# EAGLE design WiFiSensorLTC3559Spansion (EAGLE 7.3.0)
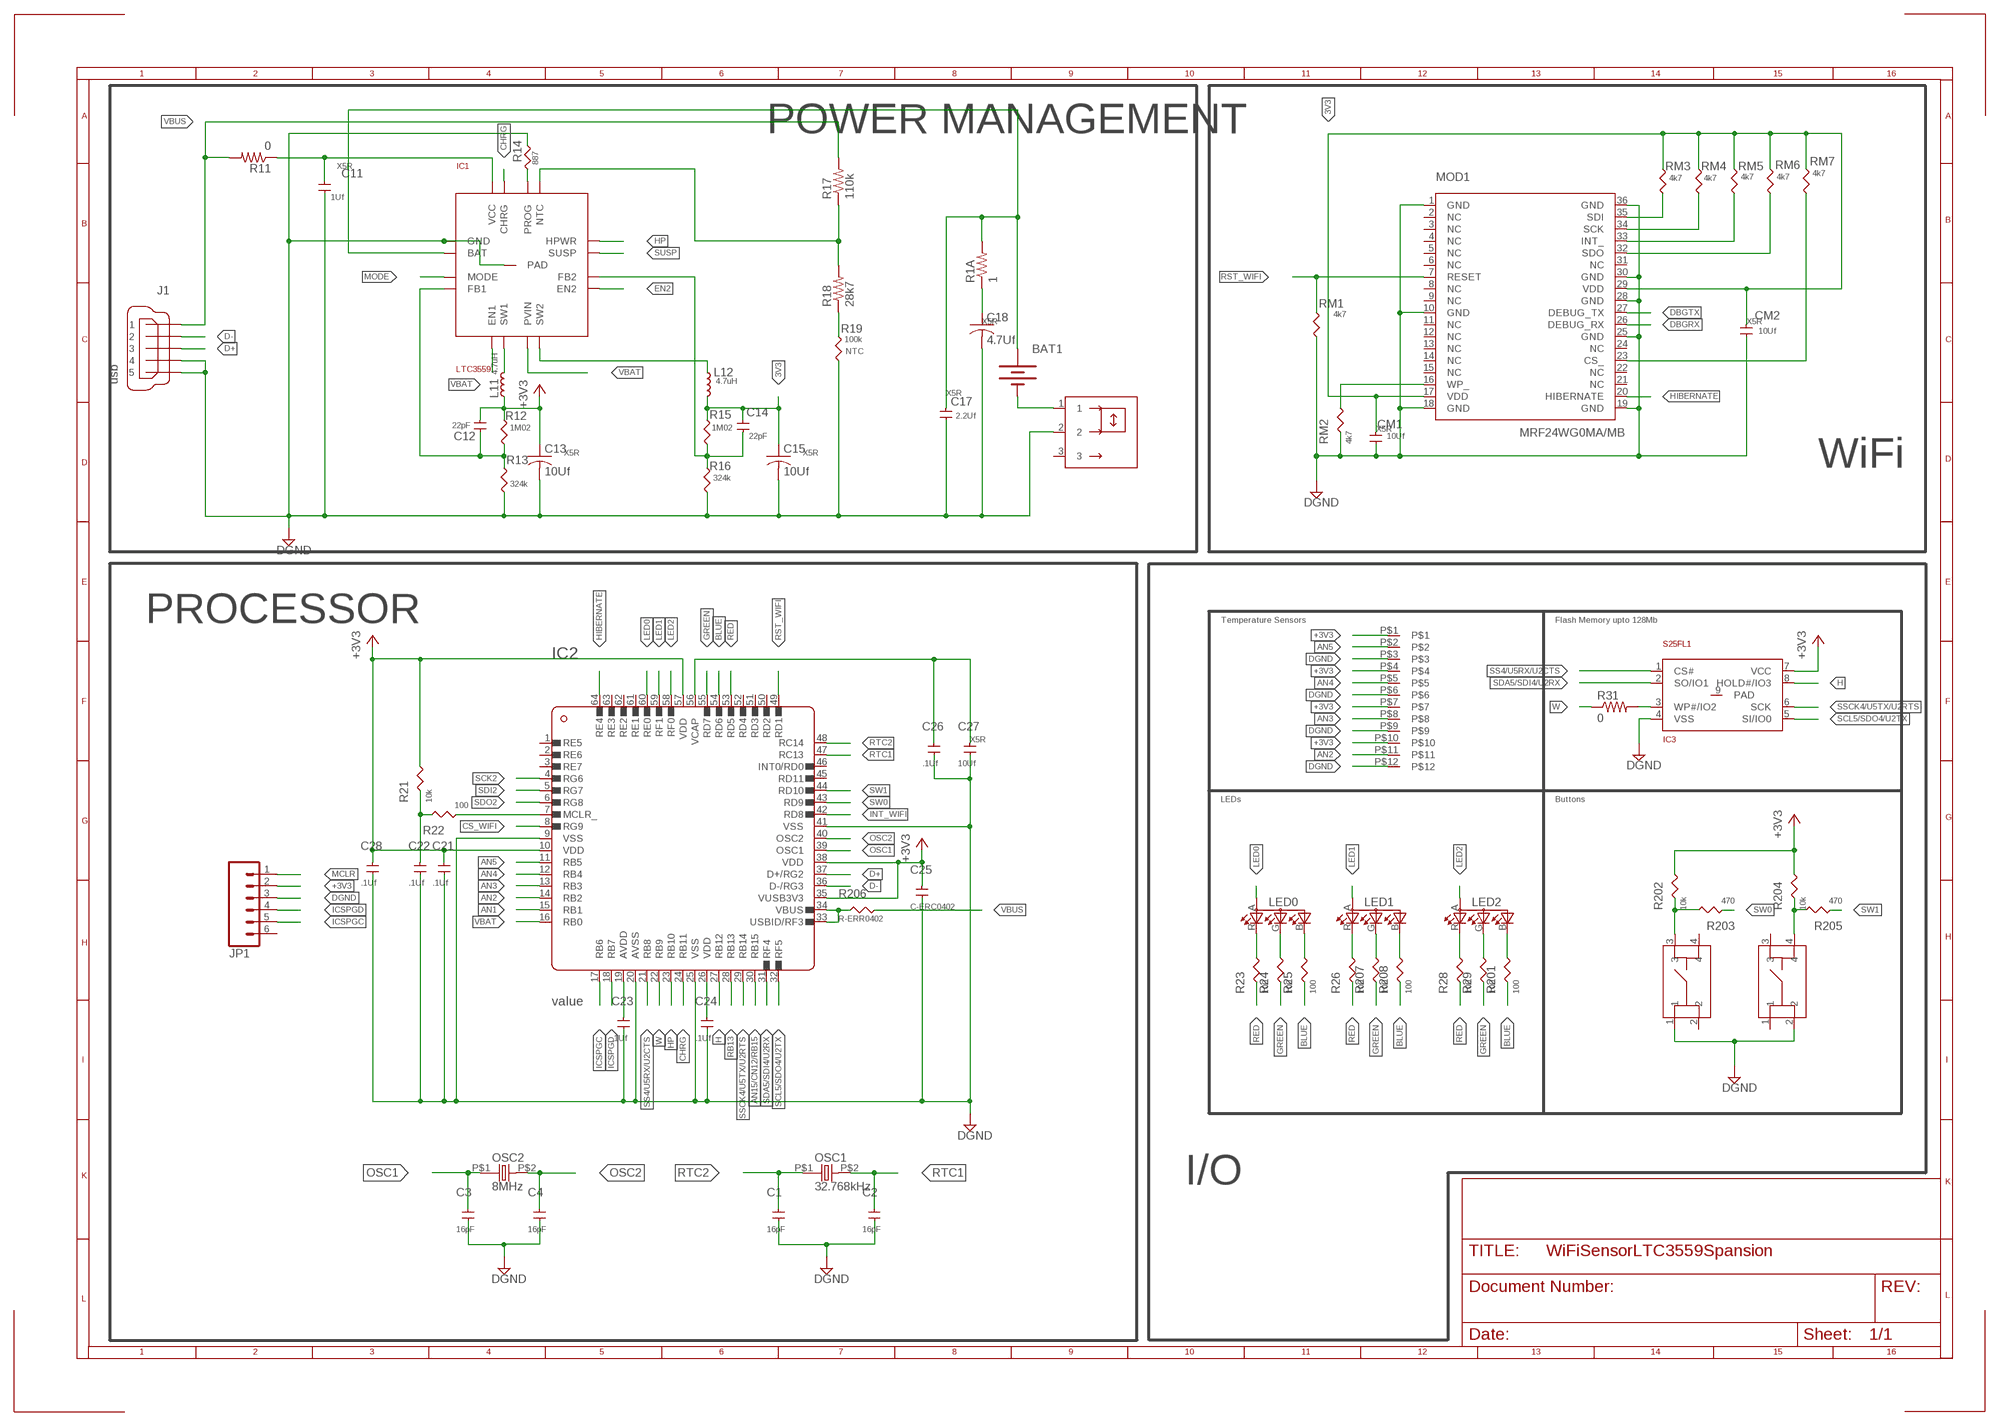
[diagram p0: schematic, sheet 1]

## Parts
BAT1  BATTERY245PTH  [BATTCON_245MM_PTH]
C1  16pF  C-ERC0402  [C0402]
C2  16pF  C-ERC0402  [C0402]
C3  16pF  C-ERC0402  [C0402]
C4  16pF  C-ERC0402  [C0402]
C11  1Uf  C-ER  [C0805]
C12  22pF  C-ERC0402  [C0402]
C13  10Uf  C-USC0805  [C0805]
C14  22pF  C-ERC0402  [C0402]
C15  10Uf  C-USC0805  [C0805]
C17  2.2Uf  C-ER  [C0805]
C18  4.7Uf  C-USC0402  [C0402]
C21  .1Uf  C-ERC0402  [C0402]
C22  .1Uf  C-ERC0402  [C0402]
C23  .1Uf  C-ERC0402  [C0402]
C24  .1Uf  C-ERC0402  [C0402]
C25  C-ERC0402  [C0402]
C26  .1Uf  C-ERC0402  [C0402]
C27  10Uf  C-ER  [C0805]
C28  .1Uf  C-ERC0402  [C0402]
CM1  10Uf  C-ER  [C0805]
CM2  10Uf  C-ER  [C0805]
IC1  LTC3559  [QFN16]
IC2  PICMX32695F512H  [TQFP64]
IC3  S25FL1  [8WSON]
J1  usb  MINI-USB-UX60A-MB-5ST  [UX60A-MB-5ST]
JP1  M06LOCK  [1X06_LOCK]
L11  4.7uH  L-ER  [L3010]
L12  4.7uH  L-ER  [L3010]
LED0  1X1RGB  [1X1]
LED1  1X1RGB  [1X1]
LED2  1X1RGB  [1X1]
MOD1  MRF24WG0MA/MB  [MRF24]
OSC1  32.768kHz  ECX32  [ECX39]
OSC2  8MHz  CX532  [CX532]
R1A  1  R-US_R0402  [R0402]
R11  0  R-US_R1206  [R1206]
R12  1M02  R-ERR0402  [R0402]
R13  324k  R-ERR0402  [R0402]
R14  887  R-ERR0402  [R0402]
R15  1M02  R-ERR0402  [R0402]
R16  324k  R-ERR0402  [R0402]
R17  110k  R-US_M0805  [M0805]
R18  28k7  R-US_M1206  [M1206]
R19  100k  R-ERR0402  [R0402]
R21  10k  R-ERR0402  [R0402]
R22  100  R-ERR0402  [R0402]
R23  100  R-ERR0402  [R0402]
R24  100  R-ERR0402  [R0402]
R25  100  R-ERR0402  [R0402]
R26  100  R-ERR0402  [R0402]
R28  100  R-ERR0402  [R0402]
R29  100  R-ERR0402  [R0402]
R31  0  R-US_M0805  [M0805]
R201  100  R-ERR0402  [R0402]
R202  10k  R-ERR0402  [R0402]
R203  470  R-ERR0402  [R0402]
R204  10k  R-ERR0402  [R0402]
R205  470  R-ERR0402  [R0402]
R206  R-ERR0402  [R0402]
R207  100  R-ERR0402  [R0402]
R208  100  R-ERR0402  [R0402]
RM1  4k7  R-ERR0402  [R0402]
RM2  4k7  R-ERR0402  [R0402]
RM3  4k7  R-ERR0402  [R0402]
RM4  4k7  R-ERR0402  [R0402]
RM5  4k7  R-ERR0402  [R0402]
RM6  4k7  R-ERR0402  [R0402]
RM7  4k7  R-ERR0402  [R0402]
SENSORS  12_127  [12-127]
SW_ON  C&K_JS  [SAQN]
U$2  ADTS  [4X5]
U$3  ADTS  [4X5]

## Nets
3V3: C14.2 C15.1 CM1.2 CM2.2 L12.P$2 MOD1.17(VDD) MOD1.29(VDD) R15.2 RM3.2 RM4.2 RM5.2 RM6.2 RM7.2
+3V3: C12.1 C13.1 C21.2 C23.2 C24.2 C25.2 C28.2 IC2.10(VDD) IC2.19(AVDD) IC2.26(VDD) IC2.35(VUSB3V3) IC2.38(VDD) IC2.57(VDD) IC3.7(VCC) JP1.2 L11.P$1 R12.2 R21.2 R202.2 R204.2 SENSORS.P$1 SENSORS.P$4 SENSORS.P$7 SENSORS.P$10
AN1: IC2.15(RB1)
AN2: IC2.14(RB2) SENSORS.P$11
AN3: IC2.13(RB3) SENSORS.P$8
AN4: IC2.12(RB4) SENSORS.P$5
AN5: IC2.11(RB5) SENSORS.P$2
AN15/CN12/RB15: IC2.30(RB15)
BLUE: IC2.54(RD6) R25.1 R201.1 R208.1
CHRG: IC1.15(CHRG) IC2.24(RB11)
CS_WIFI: IC2.8(RG9) MOD1.23(CS_) RM7.1
D+: IC2.37(D+/RG2) J1.3
D-: IC2.36(D-/RG3) J1.2
DBGRX: MOD1.26(DEBUG_RX)
DBGTX: MOD1.27(DEBUG_TX)
DGND: C1.1 C2.1 C3.1 C4.1 C11.1 C13.2 C15.2 C17.1 C18.2 C21.1 C22.1 C23.1 C24.1 C25.1 C26.1 C27.1 C28.1 CM1.1 CM2.1 IC1.1(GND) IC1.P$17(PAD) IC2.9(VSS) IC2.20(AVSS) IC2.25(VSS) IC2.41(VSS) IC3.4(VSS) J1.4 J1.5 JP1.3 MOD1.1(GND) MOD1.10(GND) MOD1.18(GND) MOD1.19(GND) MOD1.25(GND) MOD1.28(GND) MOD1.30(GND) MOD1.36(GND) R13.1 R14.1 R16.1 R19.1 RM1.1 RM2.1 SENSORS.P$3 SENSORS.P$6 SENSORS.P$9 SENSORS.P$12 SW_ON.2 U$2.2 U$3.1
EN2: IC1.9(EN2)
GREEN: IC2.55(RD7) R24.1 R29.1 R207.1
H: IC2.27(RB12) IC3.8(HOLD#/IO3)
HIBERNATE: IC2.64(RE4) MOD1.20(HIBERNATE)
HP: IC1.12(HPWR) IC2.23(RB10)
ICSPGC: IC2.17(RB6) JP1.5
ICSPGD: IC2.18(RB7) JP1.4
INT_WIFI: IC2.42(RD8) MOD1.33(INT_) RM5.1
LED0: IC2.60(RE0) LED0.A(A2)
LED1: IC2.59(RF1) LED1.A(A2)
LED2: IC2.58(RF0) LED2.A(A2)
MCLR: C22.2 JP1.1 R21.1 R22.2
MODE: IC1.3(MODE)
N$1: IC1.6(SW1) L11.P$2
N$2: IC3.3(WP#/IO2) R31.2
N$3: C12.2 IC1.4(FB1) R12.1 R13.2
N$4: IC1.13(NTC) R17.1 R18.2
N$5: R18.1 R19.2
N$6: C11.2 IC1.16(VCC) R11.1
N$7: BAT1.2(-) SW_ON.1
N$8: C18.1 R1A.1
N$10: IC1.14(PROG) R14.2
N$12: IC1.8(SW2) L12.P$1
N$15: C14.1 IC1.10(FB2) R15.1 R16.2
N$24: IC2.33(USBID/RF3) IC2.34(VBUS) R206.1
N$25: IC2.7(MCLR_) R22.1
N$26: R202.1 R203.2 U$3.3
N$31: C26.2 C27.2 IC2.56(VCAP)
N$33: R204.1 R205.2 U$2.4
N$34: LED0.R(CRED) R23.2
N$40: LED0.G(CBLUE) R24.2
N$41: MOD1.16(WP_) RM2.2
N$42: LED0.B(CGREEN) R25.2
N$43: LED1.R(CRED) R26.2
N$44: LED1.G(CBLUE) R207.2
N$45: LED1.B(CGREEN) R208.2
N$46: LED2.R(CRED) R28.2
N$47: LED2.G(CBLUE) R29.2
N$48: LED2.B(CGREEN) R201.2
OSC1: C3.2 IC2.39(OSC1) OSC2.P$1
OSC2: C4.2 IC2.40(OSC2) OSC2.P$2
RB13: IC2.28(RB13)
RED: IC2.53(RD5) R23.1 R26.1 R28.1
RST_WIFI: IC2.49(RD1) MOD1.7(RESET) RM1.2
RTC1: C2.2 IC2.47(RC13) OSC1.P$2
RTC2: C1.2 IC2.48(RC14) OSC1.P$1
SCK2: IC2.4(RG6) MOD1.34(SCK) RM4.1
SCL5/SDO4/U2TX: IC2.32(RF5) IC3.5(SI/IO0)
SDA5/SDI4/U2RX: IC2.31(RF4) IC3.2(SO/IO1)
SDI2: IC2.5(RG7) MOD1.32(SDO) RM6.1
SDO2: IC2.6(RG8) MOD1.35(SDI) RM3.1
SS4/U5RX/U2CTS: IC2.21(RB8) IC3.1(CS#)
SSCK4/U5TX/U2RTS: IC2.29(RB14) IC3.6(SCK)
SUSP: IC1.11(SUSP)
SW0: IC2.43(RD9) R203.1
SW1: IC2.44(RD10) R205.1
VBAT: BAT1.3(+) C17.2 IC1.2(BAT) IC1.5(EN1) IC1.7(PVIN) IC2.16(RB0) R1A.2
VBUS: J1.1 R11.2 R17.2 R206.2
W: IC2.22(RB9) R31.1
Unconnected: IC2.1(RE5) IC2.2(RE6) IC2.3(RE7) IC2.45(RD11) IC2.46(INT0/RD0) IC2.50(RD2) IC2.51(RD3) IC2.52(RD4) IC2.61(RE1) IC2.62(RE2) IC2.63(RE3) IC3.9(PAD) JP1.6 MOD1.2(NC) MOD1.3(NC) MOD1.4(NC) MOD1.5(NC) MOD1.6(NC) MOD1.8(NC) MOD1.9(NC) MOD1.11(NC) MOD1.12(NC) MOD1.13(NC) MOD1.14(NC) MOD1.15(NC) MOD1.21(NC) MOD1.22(NC) MOD1.24(NC) MOD1.31(NC) SW_ON.3 U$2.1 U$2.3 U$3.2 U$3.4

## Notes on the sheet
- POWER MANAGEMENT
- WiFi
- PROCESSOR | Temperature Sensors | Flash Memory upto 128Mb
- LEDs | Buttons
- I/O

## Library data of the parts
BAT1 = SparkFun:BATTERY: Battery Holders Various common sizes : AA, AAA, 20mm coin cell and 12mm coin cell.
C1-C4 C12 C14 C21-C26 C28 = rcl:C-ER
C11 C17 C27 CM1 CM2 = rcl:C-ER; TEMPCHAR: X5R
C13 C15 C18 = rcl:C-US: CAPACITOR, American symbol; TEMPCHAR: X5R
IC1 = linear-technology:LTC3559
IC2 = microchip:PICMX32695F512H
IC3 = st-microelectronics:S25FL1
J1 = con-hirose:MINI-USB-: MINI USB Connector Source: http://www.hirose.co.jp/cataloge_hp/e24000019.pdf
JP1 = SparkFun:M06: Header 6 Standard 6-pin 0.1" header. Use with straight break away headers (SKU : PRT-00116), right angle break away headers (PRT-00553), swiss pins (PRT-00743), machine pins (PRT-00117), and female headers (PRT-00115). Molex polarized connector foot print use with SKU : PRT-08094 with associated crimp pins and housings. NOTES ON THE VARIANTS LOCK and LOCK_LONGPADS... This footprint was designed to help hold the alignment of a through-hole component (i.e. 6-pin header) while soldering it into place. You may notice that each hole has been shifted either up or down by 0.005 of an inch from it's more standard position (which is a perfectly straight line). This slight alteration caused the pins (the squares in the middle) to touch the edges of the holes. Because they are alternating, it causes a "brace" to hold the component in place. 0.005 has proven to be the perfect amount of "off-center" position when using our standard breakaway headers. Although looks a little odd when you look at the bare footprint, once you have a header in there, the alteration is very hard to notice. Also, if you push a header all the way into place, it is covered up entirely on the bottom side. This idea of altering the position of holes to aid alignment will be further integrated into the Sparkfun Library for other footprints. It can help hold any component with 3 or more connection pins.
L11 L12 = rcl:L-ER
LED0 LED1 LED2 = led:1X1RGB
MOD1 = microchip:MRF24WG0MA/MB
OSC1 = crystal:ECX32; DIGIPART: XC1658CT-ND
OSC2 = crystal:CX532; DIGIPART: XC1658CT-ND
R1A R11 R17 R18 R31 = rcl:R-US_: RESISTOR, American symbol
R12-R16 R21-R26 R28 R29 R201-R208 RM1-RM7 = rcl:R-ER
R19 = rcl:R-ER; NTC: NTC
SENSORS = con-molex:12_127
SW_ON = switch:C&K_JS
U$2 U$3 = switch:ADTS

## Board
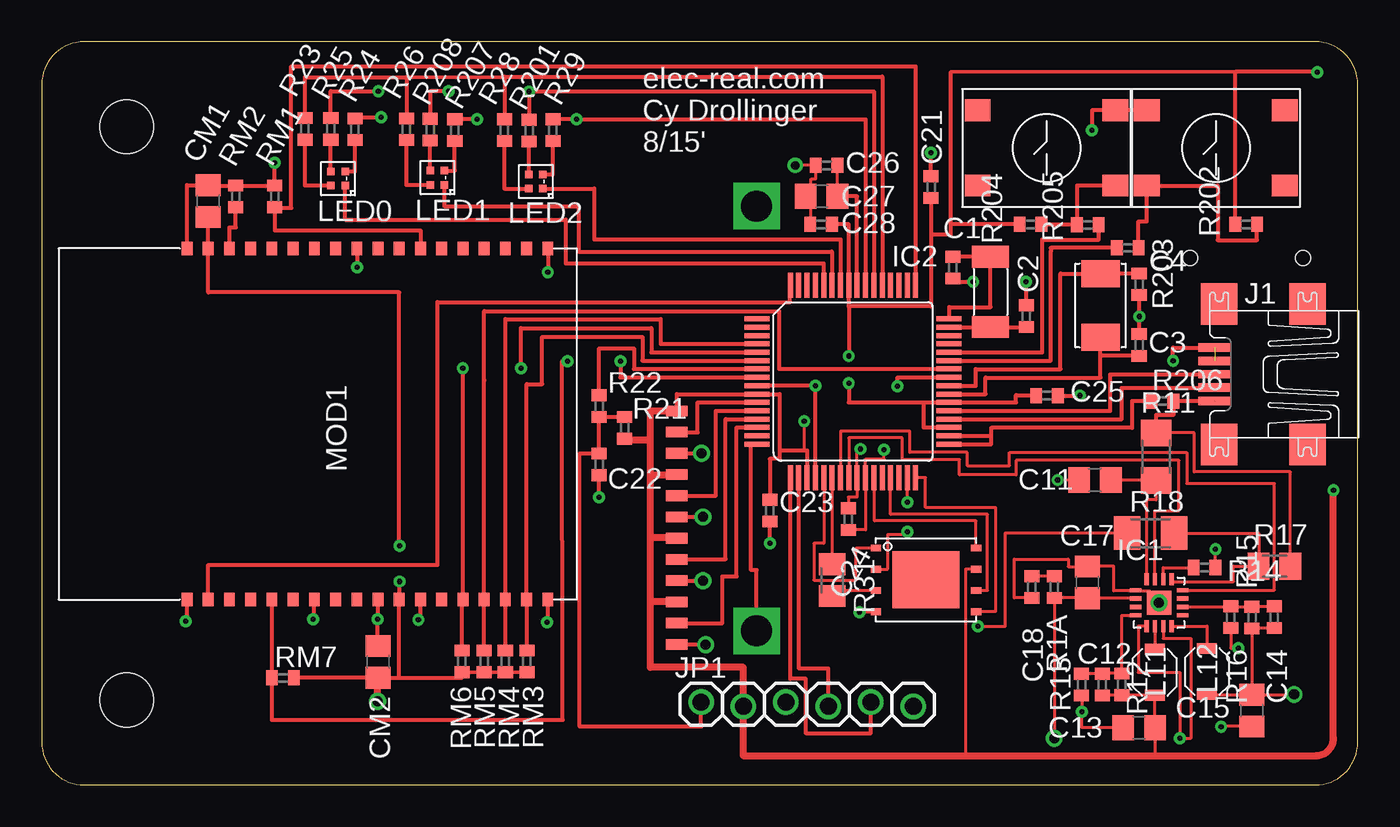
[diagram p1: board, top side]
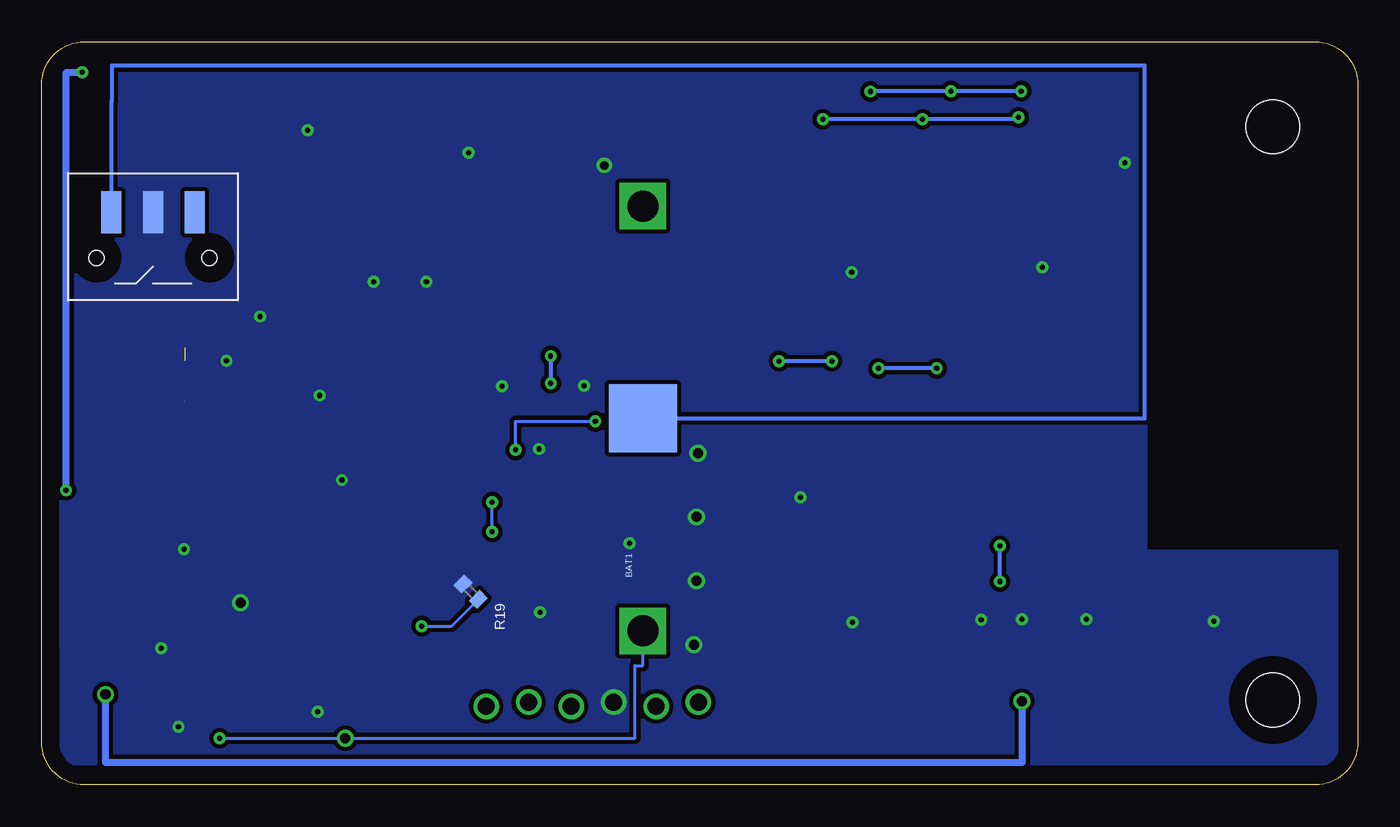
[diagram p2: board, bottom side, seen from below]

Size 78.74 x 44.45 mm. Coordinates in mm from the lower left corner, seen from the top.
Outline: 2.54,0 76.2,0 arc90 78.74,2.54 78.74,41.91 arc90 76.2,44.45 2.54,44.45 arc90 0,41.91 0,2.54 arc90 2.54,0
Copper layers (1*16): Top 0.035mm / dielectric 1.5mm / Bottom 0.035mm
Design rules "default *": minimum track width 7mil, minimum drill 12mil, track to track 8mil, track to pad 7mil, pad to pad 7mil, via to via 8mil, smd to smd 7mil, copper to edge 40mil, drill to drill 20mil, minimum pad ring 10mil, minimum via ring 8mil, stop-mask expansion 4mil, vias tented up to drill 0mil, thermal gap 10mil
Holes 3.2 mm at 5.08,5.08 5.08,39.37

### Footprints (pad centres in the part's own frame; a part is rotated, then mirrored left to right if it is on the bottom)
BATTCON_245MM_PTH = drill 1.854 square: 1 12.7,0; 3 -12.7,0 | smd 4.064 x 4.064: 2 0,0
C0402 = smd 0.7 x 0.9: 1 -0.65,0; 2 0.65,0
C0805 = smd 1.3 x 1.5: 1 -0.95,0; 2 0.95,0
QFN16 = smd 0.7 x 0.25: 1 -1.4,0.75; 2 -1.4,0.25; 3 -1.4,-0.25; 4 -1.4,-0.75; 9 1.4,-0.75; 10 1.4,-0.25; 11 1.4,0.25; 12 1.4,0.75 | smd 0.25 x 0.7: 5 -0.75,-1.4; 6 -0.25,-1.4; 7 0.25,-1.4; 8 0.75,-1.4; 13 0.75,1.4; 14 0.25,1.4; 15 -0.25,1.4; 16 -0.75,1.4 | smd 1.45 x 1.45: P$17 0,0
TQFP64 = smd 1.5 x 0.3: 1 -5.75,3.75; 2 -5.75,3.25; 3 -5.75,2.75; 4 -5.75,2.25; 5 -5.75,1.75; 6 -5.75,1.25; 7 -5.75,0.75; 8 -5.75,0.25; 9 -5.75,-0.25; 10 -5.75,-0.75; 11 -5.75,-1.25; 12 -5.75,-1.75; 13 -5.75,-2.25; 14 -5.75,-2.75; 15 -5.75,-3.25; 16 -5.75,-3.75; 33 5.75,-3.75; 34 5.75,-3.25; 35 5.75,-2.75; 36 5.75,-2.25; 37 5.75,-1.75; 38 5.75,-1.25; 39 5.75,-0.75; 40 5.75,-0.25; 41 5.75,0.25; 42 5.75,0.75; 43 5.75,1.25; 44 5.75,1.75; 45 5.75,2.25; 46 5.75,2.75; 47 5.75,3.25; 48 5.75,3.75 | smd 0.3 x 1.5: 17 -3.75,-5.75; 18 -3.25,-5.75; 19 -2.75,-5.75; 20 -2.25,-5.75; 21 -1.75,-5.75; 22 -1.25,-5.75; 23 -0.75,-5.75; 24 -0.25,-5.75; 25 0.25,-5.75; 26 0.75,-5.75; 27 1.25,-5.75; 28 1.75,-5.75; 29 2.25,-5.75; 30 2.75,-5.75; 31 3.25,-5.75; 32 3.75,-5.75; 49 3.75,5.75; 50 3.25,5.75; 51 2.75,5.75; 52 2.25,5.75; 53 1.75,5.75; 54 1.25,5.75; 55 0.75,5.75; 56 0.25,5.75; 57 -0.25,5.75; 58 -0.75,5.75; 59 -1.25,5.75; 60 -1.75,5.75; 61 -2.25,5.75; 62 -2.75,5.75; 63 -3.25,5.75; 64 -3.75,5.75
8WSON = smd 0.6 x 0.4: 1 -3,1.905; 2 -3,0.635; 3 -3,-0.635; 4 -3,-1.905; 5 3,-1.905; 6 3,-0.635; 7 3,0.635; 8 3,1.905 | smd 4 x 3.4: 9 0,0
UX60A-MB-5ST = smd 2 x 0.5: 1 2.25,1.6; 2 2.25,0.8; 3 2.25,0; 4 2.25,-0.8; 5 2.25,-1.6 | smd 2.2 x 2.5: M1 -3.3,-4.2; M2 -3.3,4.2; M3 2,4.2; M4 2,-4.2
1X06_LOCK = drill 1.016: 1 0,0; 2 2.54,-0.254; 3 5.08,0; 4 7.62,-0.254; 5 10.16,0; 6 12.7,-0.254
L3010 = smd 0.65 x 1.2: P$1 -1.375,0; P$2 1.375,0
1X1 = smd 0.45 x 0.45: A 0.425,0.425; B -0.425,-0.425; G -0.425,0.425; R 0.425,-0.425
MRF24 = smd 0.8 x 0.65: 1 -10.5,13.77; 2 -10.5,12.5; 3 -10.5,11.23; 4 -10.5,9.96; 5 -10.5,8.69; 6 -10.5,7.42; 7 -10.5,6.15; 8 -10.5,4.88; 9 -10.5,3.61; 10 -10.5,2.34; 11 -10.5,1.07; 12 -10.5,-0.2; 13 -10.5,-1.47; 14 -10.5,-2.74; 15 -10.5,-4.01; 16 -10.5,-5.28; 17 -10.5,-6.55; 18 -10.5,-7.82; 19 10.5,-7.82; 20 10.5,-6.55; 21 10.5,-5.28; 22 10.5,-4.01; 23 10.5,-2.74; 24 10.5,-1.47; 25 10.5,-0.2; 26 10.5,1.07; 27 10.5,2.34; 28 10.5,3.61; 29 10.5,4.88; 30 10.5,6.15; 31 10.5,7.42; 32 10.5,8.69; 33 10.5,9.96; 34 10.5,11.23; 35 10.5,12.5; 36 10.5,13.77
ECX39 = smd 1.3 x 2.2: P$1 -2.1,0; P$2 2.1,0
CX532 = smd 1.6 x 2.3: P$1 -1.9,0; P$2 1.9,0
R0402 = smd 0.7 x 0.9: 1 -0.65,0; 2 0.65,0
R1206 = smd 1.6 x 1.803: 1 -1.422,0; 2 1.422,0
M0805 = smd 1.3 x 1.6: 1 -0.95,0; 2 0.95,0
M1206 = smd 1.6 x 2: 1 -1.4,0; 2 1.4,0
12-127 = smd 0.635 x 1.27: P$1 -6.985,0; P$2 -5.715,0; P$3 -4.445,0; P$4 -3.175,0; P$5 -1.905,0; P$6 -0.635,0; P$7 0.635,0; P$8 1.905,0; P$9 3.175,0; P$10 4.445,0; P$11 5.715,0; P$12 6.985,0
SAQN = smd 1.194 x 2.515: 1 -2.489,2.743; 2 0,2.743; 3 2.489,2.743 | hole 0.9: -3.378,0; 3.378,0
4X5 = smd 1.55 x 1.3: 1 -4.125,2.25; 2 4.125,2.25; 3 -4.125,-2.25; 4 4.125,-2.25

### Placement (x,y rotation side)
BAT1  42.77,21.92 90 bottom
C1  54.51,30.94 90 top
C2  58.9,28.04 270 top
C3  65.66,26.31 270 top
C4  65.66,29.95 90 top
C11  63.02,18.24 0 top
C12  63.45,5.99 90 top
C13  65.66,3.43 180 top
C14  73.74,10.03 270 top
C15  72.39,4.45 270 top
C17  62.56,12.12 270 top
C18  59.23,11.84 270 top
C21  53.21,35.76 270 top
C22  33.35,19.18 90 top
C23  43.56,16.41 90 top
C24  48.26,15.9 270 top
C25  60.15,23.29 180 top
C26  46.96,37.06 0 top
C27  46.66,35.2 0 top
C28  46.63,33.53 0 top
CM1  9.96,34.92 270 top
CM2  20.12,7.37 270 top
IC1  66.85,10.9 0 top
IC2  48.54,24.13 0 top
IC3  52.91,12.27 0 top
J1  72.44,24.56 180 top
JP1  39.45,4.95 0 top
L11  66.6,6.73 90 top
L12  69.72,6.78 270 top
LED0  17.73,36.27 270 top
LED1  23.67,36.32 270 top
LED2  29.57,36.09 270 top
MOD1  16.51,21.59 270 top
OSC1  56.77,29.49 270 top
OSC2  63.35,28.68 90 top
R1A  60.58,11.84 270 top
R11  66.67,19.63 90 top
R12  64.62,6.02 270 top
R13  62.2,5.99 90 top
R14  69.57,13 180 top
R15  72.42,10.01 270 top
R16  71.15,10.03 90 top
R17  73.76,13.08 0 top
R18  66.34,15.06 0 top
R19  53.08,11.56 315 bottom
R21  34.87,21.36 270 top
R22  33.35,22.66 270 top
R23  15.75,39.24 270 top
R24  18.75,39.22 270 top
R25  17.3,39.24 270 top
R26  21.82,39.22 270 top
R28  27.69,39.17 270 top
R29  30.58,39.17 270 top
R31  47.29,12.24 270 top
R201  29.16,39.14 270 top
R202  72.06,33.53 180 top
R203  64.97,32.13 0 top
R204  59.16,33.53 180 top
R205  62.59,33.5 180 top
R206  67.06,22.96 0 top
R207  24.71,39.17 270 top
R208  23.24,39.19 270 top
RM1  13.94,35.2 270 top
RM2  11.61,35.2 270 top
RM3  29.03,7.39 270 top
RM4  27.74,7.39 270 top
RM5  26.47,7.39 270 top
RM6  25.15,7.39 270 top
RM7  14.43,6.4 0 top
SENSORS  38,15.39 270 top
SW_ON  72.09,31.52 0 bottom
U$2  60.12,38.1 0 top
U$3  70.26,38.1 0 top

### Tracks (layer width: path | path; a pad name or v marks a point on that pad's centre or on a via)
3V3  (via drill 0.3, 0.6)
  Top 0.178: L12.P$2 C15.1 | C15.1 74.93,5.39 v74.93,5.41 | C14.2 73.74,9.36 R15.2 72.39,9.36 C15.1
  Top 0.203: RM6.2 RM5.2 RM4.2 RM3.2
  Top 0.254: CM1.2 MOD1.17 9.96,29.46 21.39,29.46 21.39,14.3 v21.41,14.3 | CM2.2 20.12,6.4 | 21.39,6.42 MOD1.29 21.41,11.09 v21.41,12.17 | CM2.2 21.39,6.42 | RM7.2 15.08,6.42 CM2.2 | RM6.2 25.15,6.42 21.39,6.42
  Top 0.406: v20.09,5 20.09,6.42 CM2.2
  Bottom 0.254: v21.41,12.17 v21.41,14.3
  Bottom 0.406: v74.93,5.41 74.93,1.35 20.07,1.35 20.07,5 v20.09,5
+3V3  (via drill 0.3)
  Top 0.178: C12.1 63.45,5.37 R12.2 L11.P$1 C13.1 | C13.1 66.6,1.75 | C13.1 | C24.2 49.29,15.25 IC2.26 49.29,19.51 50.39,19.51 v50.39,20.04 | v45.62,21.74 45.62,20.02 45.52,20.02 | IC3.7 55.27,12.9 55.27,1.75
  Top 0.203: R202.2 71.48,33.53
  Top 0.254: C28.2 48.29,33.53 IC2.57 48.28,28.63 | IC2.38 54.29,22.86 | IC2.38 58.29,22.88 58.29,23.32 59.5,23.32 C25.2 | C21.2 53.21,32.92 | 53.21,32.92 53.21,28.63 48.28,28.63 | 52.76,22.89 52.76,21.38 IC2.35 | 52.76,22.89 IC2.38 | R21.2 34.87,20.73 | C23.2 43.56,19.51 44.15,19.51 44.15,20.02 | 44.15,20.02 45.52,20.02 45.8,20.02 IC2.19 | 44.15,20.02 44.15,23.38 IC2.10 38,23.38 SENSORS.P$1 | 52.76,22.89 48.28,22.89 v48.28,24.03 | 48.28,28.63 v48.28,25.65 | 71.42,42.65 76.33,42.65 v76.33,42.62 | 71.42,42.65 54.38,42.62 54.38,33.53 | 54.38,33.53 54.38,32.92 53.21,32.92 | 71.48,33.53 71.42,33.53 71.42,42.65 | R204.2 54.38,33.53
  Top 0.406: 36.42,10.95 36.42,7.04 41.99,7.04 JP1.2 41.96,4.7 41.96,1.75 55.27,1.75 66.6,1.75 76.25,1.75 arc90 77.29,2.79 v77.29,17.63 | 36.42,10.95 36.42,14.78 | 36.42,14.78 36.42,18.57 | 36.42,18.57 SENSORS.P$4 | SENSORS.P$7 38,14.78 36.42,14.78 | SENSORS.P$10 36.42,10.95 | 36.42,18.57 36.42,20.65 | 36.42,20.65 36.42,22.38 SENSORS.P$1 | R21.2 34.87,20.65 36.42,20.65
  Bottom 0.178: v50.39,20.04 50.39,21.74 v45.62,21.74
  Bottom 0.254: v48.28,25.65 v48.28,24.03
  Bottom 0.406: v77.29,17.63 77.27,42.62 v76.33,42.62
AN2
  Top 0.254: IC2.14 41.58,21.38 41.58,12.47 40.72,12.47 40.72,9.68 SENSORS.P$11
AN3
  Top 0.254: IC2.13 40.92,21.88 40.92,13.51 38,13.51 SENSORS.P$8
AN4
  Top 0.254: IC2.12 40.34,22.38 40.34,17.3 SENSORS.P$5
AN5
  Top 0.254: IC2.11 39.24,22.88 39.24,21.08 38,21.08 SENSORS.P$2
BLUE  (via drill 0.3)
  Top 0.254: R201.1 v29.16,41.48 49.79,41.48 IC2.54 | R25.1 17.3,41.5 v20.14,41.5 | R208.1 23.24,41.5 v24.33,41.5
  Bottom 0.254: v29.16,41.48 24.33,41.48 v24.33,41.5 v20.14,41.5
CHRG
  Top 0.178: IC1.15 66.6,16.41 68.05,16.41 68.05,19.41 58.29,19.41 58.29,18.54 54.91,18.54 54.91,19.46 51.49,19.46 51.49,20.75 48.29,20.75 IC2.24
CS_WIFI  (via drill 0.3)
  Top 0.254: MOD1.23 RM7.1 | RM7.1 13.79,6.71 | IC2.8 34.62,24.38 v34.62,25.35 | v31.47,25.35 31.14,25.35 31.17,3.89 13.78,3.89 RM7.1
  Bottom 0.254: v31.47,25.35 v34.62,25.35
D+
  Top 0.254: J1.3 63.93,24.56 63.93,22.38 IC2.37
D-
  Top 0.254: IC2.36 64.62,21.88 64.62,23.75 70.19,23.75 J1.2
DGND  (via drill 0.3, 0.5, 0.6)  (1 unrouted)
  Top 0.178: C28.1 45.98,34.93 C27.1 | 45.98,35.2 46.02,35.24 46.02,36.25 46.31,36.25 C26.1 v45.09,37.06 | R13.1 62.23,5.34 v62.23,4.37 62.23,3.43 C13.2 | C15.2 70.56,3.5 v70.56,3.48 | R16.1 71.14,8.18 v71.6,8.18 | v49,20.09 48.79,20.09 IC2.25 48.79,17.22 48.26,17.22 C24.1 | IC3.4 49.91,10.34 v48.92,10.34 | R14.1 v70.23,14.1 70.21,14.1 | C11.1 v60.78,18.24 | IC1.1 65.45,11.61 | 65.45,11.61 66.29,11.61 66.29,10.9 IC1.P$17 | 65.45,11.61 64.14,11.61 64.14,13.08 C17.1 62.56,13.06 61.42,13.06 61.42,13.51 58.19,13.51 58.19,11.19 C18.2
  Top 0.203: 20.12,8.02 CM2.1 20.09,8.02
  Top 0.254: MOD1.19 8.69,9.78 v8.61,9.78 8.66,9.78 | MOD1.25 16.31,9.91 v16.23,9.91 | MOD1.28 20.12,9.91 v20.09,9.91 20.09,8.02 | MOD1.36 30.28,9.73 v30.23,9.73 | MOD1.30 22.66,9.88 v22.53,9.88 | C27.1 45.98,35.2 | v13.95,37.21 RM1.1 RM2.1 9.96,35.85 CM1.1 8.69,35.88 MOD1.18 | MOD1.1 v30.28,30.66 | J1.5 67.69,26.16 v67.69,25.38 67.69,25.64 | MOD1.10 18.87,32.09 v18.87,30.96 | IC2.9 45.31,23.88 v46.3,23.88 46.3,18.38 IC2.20 | IC2.41 51.21,24.38 v51.21,23.85 | C21.1 v53.21,37.82 | C1.1 54.51,30.1 v55.73,30.1 | C2.1 58.9,30.1 v58.88,30.1 | v33.35,17.2 C22.1 | SENSORS.P$3 v39.47,19.84 | SENSORS.P$6 v39.57,16.03 | SENSORS.P$12 39.73,8.41 v39.73,8.38 | SENSORS.P$9 v39.57,12.22 | v43.56,14.45 C23.1 | U$2.2 U$3.1 62.84,40.35 v62.84,39.17 | C3.1 65.66,28.02 v65.68,28.02 65.68,29.3 C4.1 | C25.1 v62.1,23.29
  other vias: 66.85,10.9
  pour Bottom (isolate 0.254, no thermals): 1.27,1.27 77.55,1.24 77.62,43.03 12.7,43.18 12.7,13.97 1.27,13.97
GREEN  (via drill 0.3)
  Top 0.254: R29.1 v32,39.82 49.29,39.82 IC2.55 | R24.1 18.75,39.93 v20.3,39.93 | v26.04,39.82 R207.1
  Bottom 0.254: v20.3,39.93 20.3,39.82 v26.04,39.82 v32,39.82
H
  Top 0.178: IC3.8 55.91,15.8 49.84,15.8 49.84,18.38 IC2.27
HIBERNATE
  Top 0.254: MOD1.20 9.96,13.16 23.67,13.16 23.67,28.88 44.78,28.88 IC2.64
HP
  Top 0.178: 47.78,18.38 IC2.23 47.8,18.38 47.8,21.16 51.94,21.16 51.94,19.89 55.37,19.89 55.37,19.1 57.91,19.1 57.91,19.89 68.5,19.89 68.5,18.03 73.76,18.03 73.76,11.65 IC1.12
ICSPGC
  Top 0.254: IC2.17 44.79,6.35 45.72,6.35 45.72,3.1 49.61,3.1 JP1.5
ICSPGD
  Top 0.254: JP1.4 47.07,6.96 45.31,6.96 45.31,18.38 IC2.18
INT_WIFI
  Top 0.254: RM5.1 MOD1.33 26.47,24.18 26.47,24.21 26.47,28.35 44.12,28.35 44.12,24.88 IC2.42
LED0
  Top 0.254: LED0.A 18.15,33.81 31.34,33.81 31.34,31.19 46.79,31.19 IC2.60
LED1
  Top 0.254: LED1.A 24.1,34.62 32.13,34.62 32.13,31.9 47.27,31.9 47.27,29.88 IC2.59
LED2
  Top 0.254: LED2.A 33.05,35.67 33.05,32.64 47.79,32.64 IC2.58
MCLR
  Top 0.254: JP1.1 39.45,3.5 32.18,3.5 32.18,19.83 C22.2 R22.2 R21.1
N$1
  Top 0.178: IC1.6 L11.P$2
N$2
  Top 0.178: R31.2 47.3,11.63 IC3.3
N$3
  Top 0.178: R13.2 C12.2 63.45,6.67 R12.1 64.62,10.15 IC1.4
N$4
  Top 0.178: R18.2 72.81,15.06 R17.1 71.3,13.08 71.3,12.17 67.6,12.17 IC1.13
N$5  (via drill 0.3)
  Top 0.178: R18.1 57.63,15.06 57.63,9.47 56.01,9.47 v56.01,9.5
  Bottom 0.178: v56.01,9.5 54.22,9.5 R19.2
N$6
  Top 0.178: IC1.16 66.1,17.03 arc-90 66.12,17.04 66.67,17.04 R11.1 66.67,18.24 C11.2
N$7
  Bottom 0.254: SW_ON.1 74.57,40.89 74.55,40.89 74.55,43.03 12.75,43.03 12.75,21.92 BAT1.2
N$8
  Top 0.178: R1A.1 C18.1
N$10
  Top 0.178: IC1.14 67.1,13.01 R14.2
N$12
  Top 0.178: IC1.8 69.72,9.5 L12.P$1
N$15
  Top 0.178: R16.2 | R16.2 71.14,10.66 R15.1 72.42,10.68 C14.1 | IC1.10 71.14,10.65 R16.2
N$24
  Top 0.254: IC2.34 arc-90 IC2.34 56.82,20.88 | 56.82,20.88 56.82,21.36 65.23,21.36 65.23,22.96 R206.1 | IC2.33 56.82,20.38 56.82,20.88
N$25
  Top 0.254: R22.1 33.35,26.11 35.43,26.11 35.43,24.88 IC2.7
N$26
  Top 0.254: R202.1 72.71,32.59 70.36,32.59 70.36,35.85 U$3.3 66.12,35.85 66.12,33.71 65.62,33.71 R203.2
N$31
  Top 0.178: C27.2 C26.2
  Top 0.254: C27.2 48.79,35.2 IC2.56
N$33
  Top 0.254: R204.1 59.81,33.5 R205.2 61.94,35.85 U$2.4
N$34
  Top 0.254: LED0.R 15.75,35.85 R23.2
N$40
  Top 0.254: LED0.G 18.75,36.7 R24.2
N$41
  Top 0.254: MOD1.16 11.23,33.35 11.61,33.35 RM2.2
N$42
  Top 0.254: LED0.B R25.2
N$43
  Top 0.254: LED1.R 21.82,35.9 R26.2
N$44
  Top 0.254: LED1.G 24.71,36.75 R207.2
N$45
  Top 0.254: R208.2 LED1.B
N$46
  Top 0.254: LED2.R 27.69,35.67 R28.2
N$47
  Top 0.254: LED2.G 30.58,36.52 R29.2
N$48
  Top 0.254: LED2.B 29.16,36.52 R201.2
OSC1
  Top 0.254: IC2.39 56.46,23.38 56.46,24.36 63.35,24.36 63.35,25.68 | 63.35,25.68 OSC2.P$1 | C3.2 65.66,25.68 63.35,25.68
OSC2
  Top 0.254: IC2.40 55.88,23.88 55.88,24.87 60.96,24.87 60.96,30.58 OSC2.P$2 63.35,30.6 C4.2
RED
  Top 0.254: 27.69,42.37 R28.1 | IC2.53 50.29,42.37 27.69,42.37 | R23.1 15.75,42.34 21.82,42.34 | 21.82,42.34 27.69,42.37 | 21.82,42.34 R26.1
RST_WIFI
  Top 0.254: MOD1.7 22.66,33.17 13.95,33.17 RM1.2 13.95,34.52 14.94,34.52 14.94,42.98 52.29,42.98 IC2.49
RTC1
  Top 0.254: IC2.47 OSC1.P$2 C2.2
RTC2
  Top 0.254: C1.2 OSC1.P$1 56.77,28.57 54.3,28.57 54.3,27.88 IC2.48
SCK2
  Top 0.254: RM4.1 MOD1.34 27.74,27.86 37.03,27.86 37.03,26.38 IC2.4
SCL5/SDO4/U2TX
  Top 0.178: IC3.5 57.07,10.36 57.07,16.59 52.88,16.59 52.88,18.38 IC2.32
SDA5/SDI4/U2RX  (via drill 0.3)
  Top 0.178: IC3.2 50.62,12.9 50.62,14.99 51.79,14.99 v51.79,15.14 | v51.79,16.92 51.79,16.89 IC2.31
  Bottom 0.178: v51.79,15.14 v51.79,16.92
SDI2  (via drill 0.3)
  Top 0.254: RM6.1 25.15,11.09 MOD1.32 v25.2,24.92 | v28.68,24.92 28.68,27.33 36.47,27.33 36.47,25.88 IC2.5
  Bottom 0.254: v25.2,24.92 v28.68,24.92
SDO2
  Top 0.254: RM3.1 29.03,11.09 MOD1.35 29.01,23.98 29.95,23.98 29.95,26.8 35.94,26.8 35.94,25.38 IC2.6
SS4/U5RX/U2CTS
  Top 0.178: IC2.21 46.79,14.45 46.2,14.45 46.2,12.24 48.72,12.24 48.72,14.17 IC3.1
SSCK4/U5TX/U2RTS
  Top 0.178: IC3.6 56.59,11.63 56.59,16.18 50.79,16.18 IC2.29
SW0
  Top 0.254: IC2.43 60.38,25.38 60.38,31.8 60.38,31.9 60.38,32.13 R203.1
SW1
  Top 0.254: IC2.44 59.87,25.88 59.87,32.61 63.25,32.61 R205.1
VBAT  (via drill 0.3, 0.6)
  Top 0.178: IC1.5 65.61,9.5 65.61,6.73 68.12,6.73 68.12,2.79 | IC1.2 65.45,11.17 C17.2 62.56,11.19 R1A.2 v60.58,2.79 | IC1.7 67.1,8.76 68.76,8.76 68.76,2.79 68.12,2.79 | v68.1,2.79 68.12,2.79
  Top 0.254: 42.77,20.38 IC2.16 42.44,20.38 42.44,12.85 42.77,12.85 BAT1.3
  Bottom 0.178: BAT1.3 42.77,7.14 43.26,7.14 43.26,2.79 v60.58,2.79 v68.1,2.79
VBUS  (1 unrouted)
  Top 0.178: R17.2 74.71,18.72 68.96,18.72 68.96,21.06 R11.2
  Top 0.254: J1.1 R206.2 67.71,22.12 66.67,22.12 R11.2
W
  Top 0.178: IC2.22 R31.1

### Text on the board
tPlace: elec-real.com / Cy Drollinger / 8/15'